# EAGLE design ford_q3 (EAGLE 9.6.2)
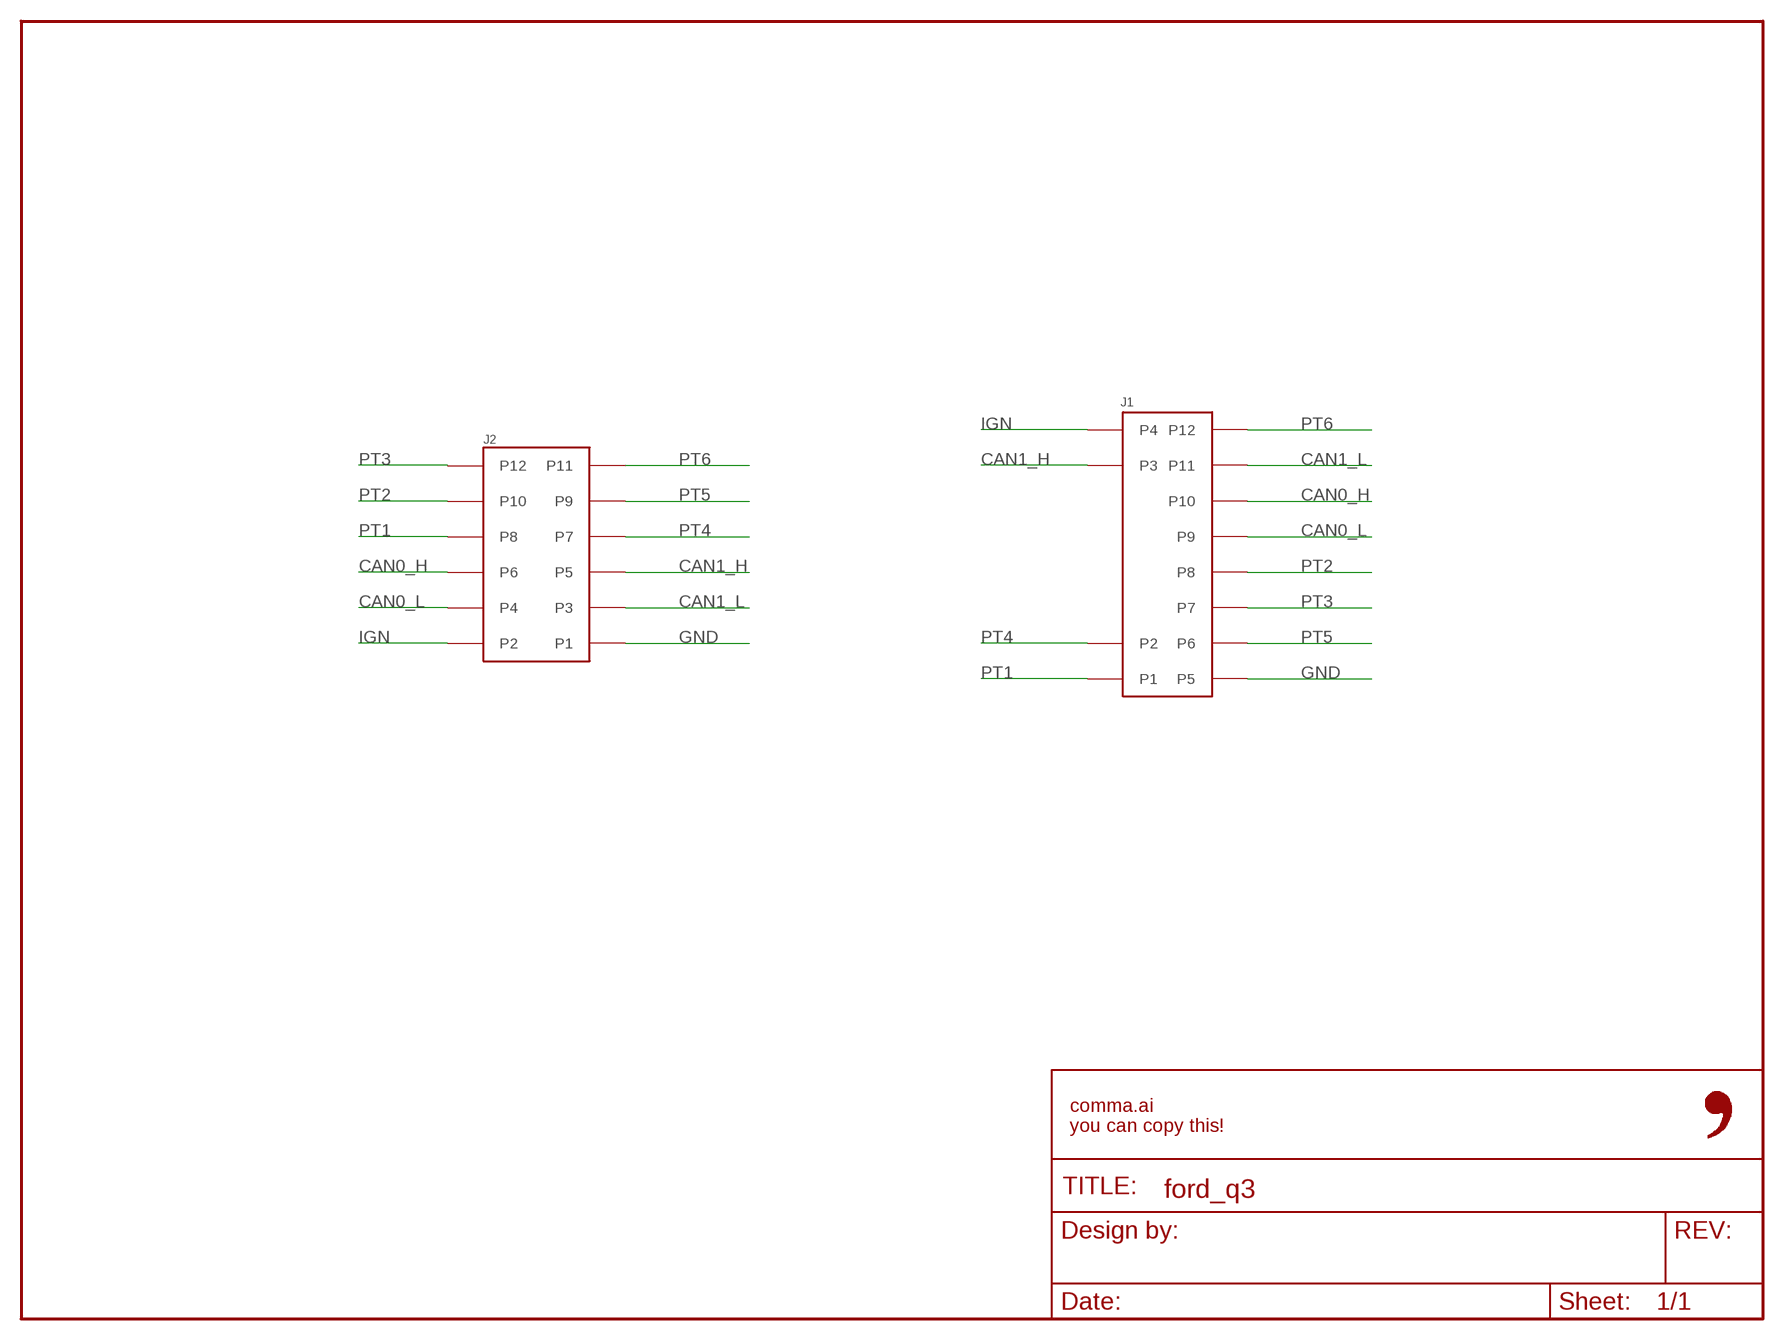
[diagram p0: schematic, sheet 1]

## Parts
FRAME1  FRAME-LETTER-OPENNO_PACKAGE  [DUMMY]
J1  0348260124  [0348260124]
J2  5018761240  [5018761240]

## Nets
CAN0_H: J1.P10 J2.P6
CAN0_L: J1.P9 J2.P4
CAN1_H: J1.P3 J2.P5
CAN1_L: J1.P11 J2.P3
GND: J1.P5 J2.P1
IGN: J1.P4 J2.P2
PT1: J1.P1 J2.P8
PT2: J1.P8 J2.P10
PT3: J1.P7 J2.P12
PT4: J1.P2 J2.P7
PT5: J1.P6 J2.P9
PT6: J1.P12 J2.P11

## Library data of the parts
FRAME1 = comma.ai:FRAME-LETTER-OPEN: Schematic Frame - Letter Standard 8.5x11 US Letter frame; DESIGNER: Nobody; VERSION: v01
J1 = 0348240124:0348260124; CPN: CAI-HARNESS-MOLEX-0348260124
J2 = comma.ai:5018761240; CPN: CAI-HARNESS-MOLEX-5018761240

## Board
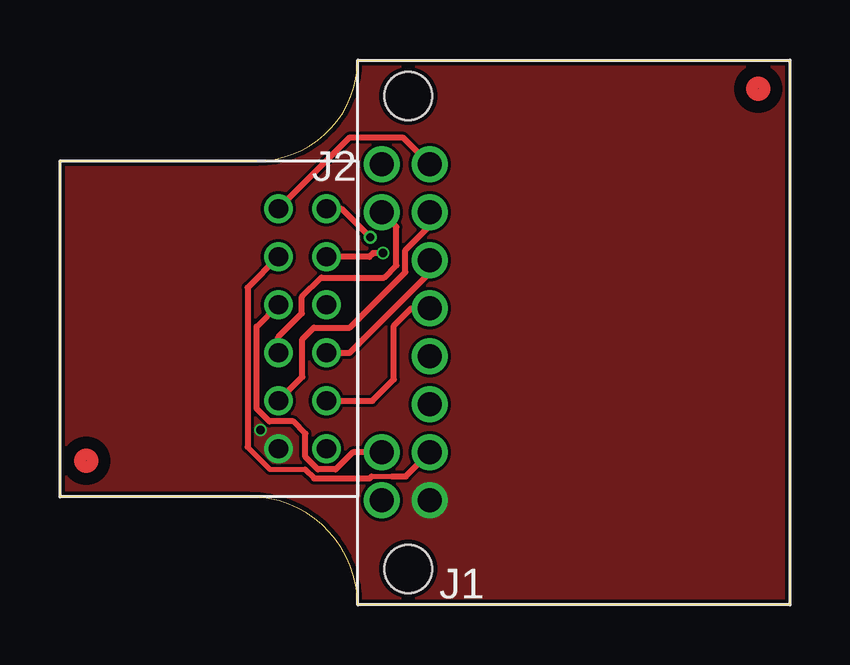
[diagram p1: board, top side]
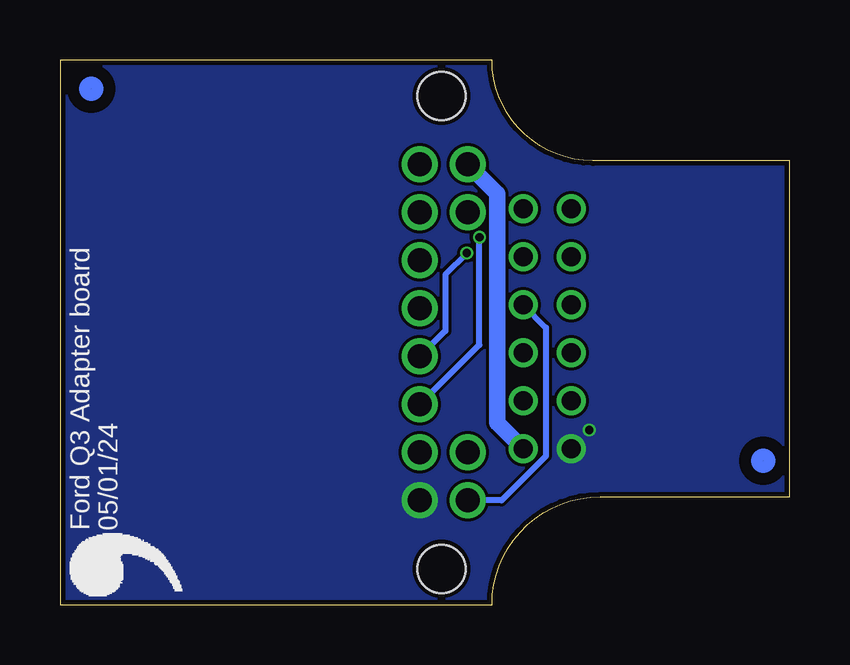
[diagram p2: board, bottom side, seen from below]

Size 30.4 x 22.7 mm. Coordinates in mm from the lower left corner, seen from the top.
Outline: 0,18.5 8.2,18.5 arc90 12.4,22.7 30.4,22.7 30.4,0 12.4,0 arc90 7.9,4.5 0,4.5 0,18.5
Copper layers (1*16): Top 0.035mm / dielectric 1.5mm / Bottom 0.035mm
Design rules "jlcpcb_2layer": minimum track width 5mil, minimum drill 12mil, track to track 5mil, track to pad 5mil, pad to pad 5mil, via to via 5mil, smd to smd 5mil, copper to edge 8mil, drill to drill 8mil, minimum pad ring 3mil, minimum via ring 3mil, stop-mask expansion 4mm, vias tented up to drill 20mil, thermal gap 10mil

### Footprints (pad centres in the part's own frame; a part is rotated, then mirrored left to right if it is on the bottom)
0348260124 = drill 1: P1 -7,2; P2 -5,2; P3 5,2; P4 7,2; P5 -7,0; P6 -5,0; P7 -3,0; P8 -1,0; P9 1,0; P10 3,0; P11 5,0; P12 7,0 | hole 2: -9.85,0.9; 9.85,0.9
5018761240 = drill 0.8: P1 5,-1; P2 5,1; P3 3,-1; P4 3,1; P5 1,-1; P6 1,1; P7 -1,-1; P8 -1,1; P9 -3,-1; P10 -3,1; P11 -5,-1; P12 -5,1

### Placement (x,y rotation side)
FRAME1  -0.92,-2.06 0 top
J1  15.41,11.35 90 top
J2  10.1,11.5 270 top
U$1  [LOGO]  25.01,-0.31 90 bottom
U$2  [FIDUCIAL]  29.1,21.5 0 top
U$3  [FIDUCIAL]  1.1,6 0 top

### Tracks (layer width: path | path; a pad name or v marks a point on that pad's centre or on a via)
CAN0_H
  Top 0.254: J2.P6 12.07,10.5 15.41,13.84 J1.P10
CAN0_L
  Top 0.254: J2.P4 13.02,8.5 13.91,9.39 13.91,11.63 14.63,12.35 J1.P9
CAN1_H
  Top 0.254: J2.P5 9.1,11.16 10.08,12.15 10.08,12.83 10.89,13.64 13.5,13.64 14.01,14.14 14.01,15.75 J1.P3
CAN1_L
  Top 0.254: J2.P3 10.1,9.5 10.1,11.07 10.58,11.55 12.08,11.55 14.39,13.87 14.39,14.78 15.41,15.79 J1.P11
GND  (via drill 0.35)
  other vias: 8.35,7.29
  pour Top (no thermals): -6.31,25.02 34.69,25.02 34.69,-2.98 -6.31,-2.98
  pour Bottom (no thermals): -7.31,26.02 35.69,26.02 35.69,-3.98 -7.31,-3.98
IGN
  Bottom 0.69: J1.P4 12.18,17.12 12.18,7.58 J2.P2
PT1
  Bottom 0.254: J2.P8 10.15,11.55 10.15,6.19 11.99,4.35 J1.P1
PT2  (via drill 0.35)
  Top 0.254: v13.45,14.65 13.05,14.65 12.89,14.5 J2.P10
  Bottom 0.254: v13.45,14.65 14.34,13.76 14.34,11.42 J1.P8
PT3  (via drill 0.35)
  Top 0.254: v12.93,15.31 v12.92,15.31 11.73,16.5 J2.P12
  Bottom 0.254: J1.P7 12.93,10.83 v12.93,15.31
PT4
  Top 0.254: J1.P2 12.19,6.35 11.48,5.65 10.75,5.65 10.23,6.17 10.23,7.13 9.72,7.64 8.73,7.64 8.2,8.18 8.2,11.6 J2.P7
PT5
  Top 0.203: 12.99,5.35 13.83,5.35 | 7.81,6.58 8.74,5.65 10.21,5.65
  Top 0.254: J1.P6 14.41,5.35 13.83,5.35 | J2.P9 7.81,13.21 7.81,6.58 | 12.99,5.35 12.9,5.26 10.59,5.26 10.21,5.65
PT6
  Top 0.254: J2.P11 12.08,19.48 14.28,19.48 J1.P12

### Text on the board
bNames: 05/01/24 | Ford Q3 Adapter board